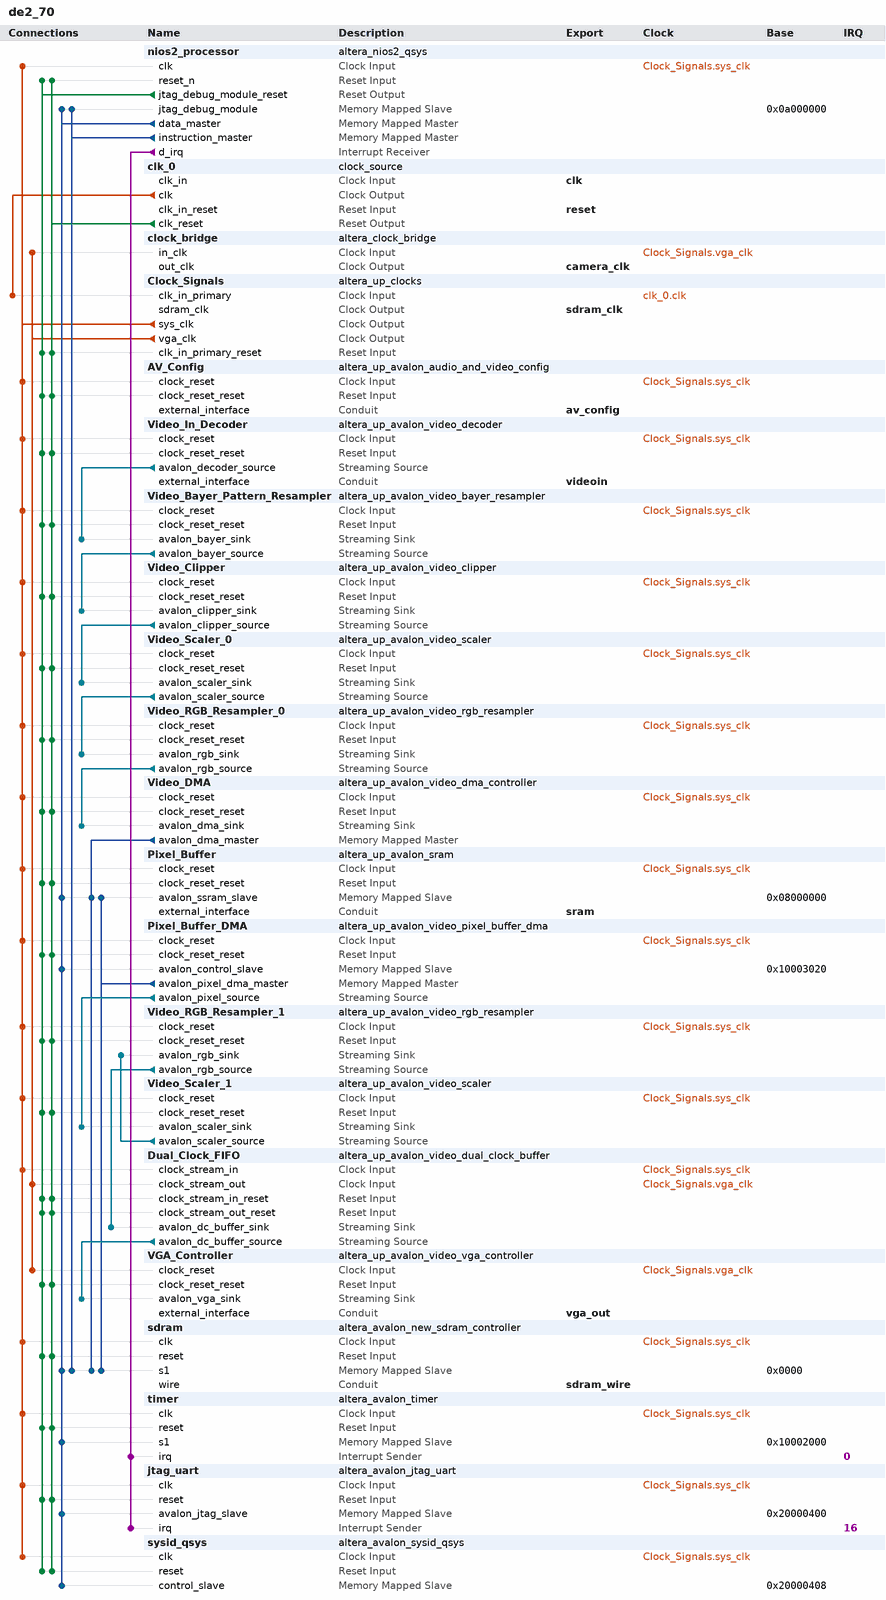
[diagram p0: system contents]
# Platform Designer (Qsys) system de2_70, Cyclone II EP2C70F896C6
# Parameters at their usual value, and those the tool derives, are not listed.
package require -exact qsys 13.0
create_system de2_70
set_project_property DEVICE_FAMILY {Cyclone II}
set_project_property DEVICE EP2C70F896C6

add_instance nios2_processor altera_nios2_qsys 13.0
set_instance_parameter_value nios2_processor resetSlave sdram.s1
set_instance_parameter_value nios2_processor mmu_TLBMissExcSlave None
set_instance_parameter_value nios2_processor exceptionSlave sdram.s1
set_instance_parameter_value nios2_processor breakSlave nios2_processor.jtag_debug_module
set_instance_parameter_value nios2_processor impl Fast
set_instance_parameter_value nios2_processor icache_size 4096

add_instance clk_0 clock_source 13.0
set_instance_parameter_value clk_0 clockFrequency 50000000

add_instance clock_bridge altera_clock_bridge 13.0
set_instance_parameter_value clock_bridge DERIVED_CLOCK_RATE 25000000
set_instance_parameter_value clock_bridge EXPLICIT_CLOCK_RATE 25000000

add_instance Clock_Signals altera_up_clocks 13.0
set_instance_parameter_value Clock_Signals board DE2-70
set_instance_parameter_value Clock_Signals vga_clk true
set_instance_parameter_value Clock_Signals audio_clk false
set_instance_parameter_value Clock_Signals audio_clk_freq 12.288

add_instance AV_Config altera_up_avalon_audio_and_video_config 13.0
set_instance_parameter_value AV_Config board DE2-70
set_instance_parameter_value AV_Config audio_in {Microphone to ADC}
set_instance_parameter_value AV_Config line_in_bypass false
set_instance_parameter_value AV_Config bit_length 24
set_instance_parameter_value AV_Config sampling_rate {48 kHz}

add_instance Video_In_Decoder altera_up_avalon_video_decoder 13.0
set_instance_parameter_value Video_In_Decoder video_source {5MP Daughtercard (THDB_D5M)}

add_instance Video_Bayer_Pattern_Resampler altera_up_avalon_video_bayer_resampler 13.0
set_instance_parameter_value Video_Bayer_Pattern_Resampler use_custom_format true
set_instance_parameter_value Video_Bayer_Pattern_Resampler custom_width_in 2592
set_instance_parameter_value Video_Bayer_Pattern_Resampler custom_height_in 1944

add_instance Video_Clipper altera_up_avalon_video_clipper 13.0
set_instance_parameter_value Video_Clipper width_in 1296
set_instance_parameter_value Video_Clipper height_in 972
set_instance_parameter_value Video_Clipper drop_left 8
set_instance_parameter_value Video_Clipper drop_right 8
set_instance_parameter_value Video_Clipper drop_top 6
set_instance_parameter_value Video_Clipper drop_bottom 6
set_instance_parameter_value Video_Clipper color_bits 8
set_instance_parameter_value Video_Clipper color_planes 3

add_instance Video_Scaler_0 altera_up_avalon_video_scaler 13.0
set_instance_parameter_value Video_Scaler_0 width_scaling 0.25
set_instance_parameter_value Video_Scaler_0 height_scaling 0.25
set_instance_parameter_value Video_Scaler_0 width_in 1280
set_instance_parameter_value Video_Scaler_0 height_in 960
set_instance_parameter_value Video_Scaler_0 color_bits 8
set_instance_parameter_value Video_Scaler_0 color_planes 3

add_instance Video_RGB_Resampler_0 altera_up_avalon_video_rgb_resampler 13.0
set_instance_parameter_value Video_RGB_Resampler_0 input_type {24-bit RGB}
set_instance_parameter_value Video_RGB_Resampler_0 output_type {8-bit Grayscale}
set_instance_parameter_value Video_RGB_Resampler_0 alpha 1023

add_instance Video_DMA altera_up_avalon_video_dma_controller 13.0
set_instance_parameter_value Video_DMA mode {From Stream to Memory}
set_instance_parameter_value Video_DMA addr_mode Consecutive
set_instance_parameter_value Video_DMA start_address 134217728
set_instance_parameter_value Video_DMA back_start_address 134217728
set_instance_parameter_value Video_DMA width 320
set_instance_parameter_value Video_DMA height 240
set_instance_parameter_value Video_DMA color_bits 8
set_instance_parameter_value Video_DMA color_planes 1
set_instance_parameter_value Video_DMA dma_enabled true

add_instance Pixel_Buffer altera_up_avalon_sram 13.0
set_instance_parameter_value Pixel_Buffer board DE2-70
set_instance_parameter_value Pixel_Buffer pixel_buffer true

add_instance Pixel_Buffer_DMA altera_up_avalon_video_pixel_buffer_dma 13.0
set_instance_parameter_value Pixel_Buffer_DMA addr_mode Consecutive
set_instance_parameter_value Pixel_Buffer_DMA start_address 134217728
set_instance_parameter_value Pixel_Buffer_DMA back_start_address 134217728
set_instance_parameter_value Pixel_Buffer_DMA image_width 320
set_instance_parameter_value Pixel_Buffer_DMA image_height 240
set_instance_parameter_value Pixel_Buffer_DMA color_space {8-bit Grayscale}

add_instance Video_RGB_Resampler_1 altera_up_avalon_video_rgb_resampler 13.0
set_instance_parameter_value Video_RGB_Resampler_1 input_type {8-bit Grayscale}
set_instance_parameter_value Video_RGB_Resampler_1 output_type {30-bit RGB}
set_instance_parameter_value Video_RGB_Resampler_1 alpha 1023

add_instance Video_Scaler_1 altera_up_avalon_video_scaler 13.0
set_instance_parameter_value Video_Scaler_1 width_scaling 2
set_instance_parameter_value Video_Scaler_1 height_scaling 2
set_instance_parameter_value Video_Scaler_1 width_in 320
set_instance_parameter_value Video_Scaler_1 color_bits 8
set_instance_parameter_value Video_Scaler_1 color_planes 1

add_instance Dual_Clock_FIFO altera_up_avalon_video_dual_clock_buffer 13.0
set_instance_parameter_value Dual_Clock_FIFO color_bits 10

add_instance VGA_Controller altera_up_avalon_video_vga_controller 13.0
set_instance_parameter_value VGA_Controller board DE2-70

add_instance sdram altera_avalon_new_sdram_controller 13.0.1.99.2
set_instance_parameter_value sdram TAC 5.5
set_instance_parameter_value sdram TRCD 20.0
set_instance_parameter_value sdram TRP 20.0
set_instance_parameter_value sdram casLatency 3
set_instance_parameter_value sdram columnWidth 8
set_instance_parameter_value sdram dataWidth 16
set_instance_parameter_value sdram generateSimulationModel false
set_instance_parameter_value sdram model single_Micron_MT48LC4M32B2_7_chip
set_instance_parameter_value sdram numberOfBanks 4
set_instance_parameter_value sdram numberOfChipSelects 1
set_instance_parameter_value sdram powerUpDelay 100.0
set_instance_parameter_value sdram refreshPeriod 15.625
set_instance_parameter_value sdram rowWidth 12

add_instance timer altera_avalon_timer 13.0.1.99.2
set_instance_parameter_value timer period 1
set_instance_parameter_value timer periodUnits MSEC

add_instance jtag_uart altera_avalon_jtag_uart 13.0.1.99.2
set_instance_parameter_value jtag_uart simInteractiveOptions NO_INTERACTIVE_WINDOWS

add_instance sysid_qsys altera_avalon_sysid_qsys 13.0
set_instance_parameter_value sysid_qsys id 0

# connections
add_connection clk_0.clk Clock_Signals.clk_in_primary clock
add_connection Clock_Signals.sys_clk AV_Config.clock_reset clock
add_connection Clock_Signals.sys_clk Dual_Clock_FIFO.clock_stream_in clock
add_connection Clock_Signals.sys_clk jtag_uart.clk clock
add_connection Clock_Signals.sys_clk nios2_processor.clk clock
add_connection Clock_Signals.sys_clk Pixel_Buffer.clock_reset clock
add_connection Clock_Signals.sys_clk Pixel_Buffer_DMA.clock_reset clock
add_connection Clock_Signals.sys_clk sdram.clk clock
add_connection Clock_Signals.sys_clk sysid_qsys.clk clock
add_connection Clock_Signals.sys_clk timer.clk clock
add_connection Clock_Signals.sys_clk Video_Bayer_Pattern_Resampler.clock_reset clock
add_connection Clock_Signals.sys_clk Video_Clipper.clock_reset clock
add_connection Clock_Signals.sys_clk Video_DMA.clock_reset clock
add_connection Clock_Signals.sys_clk Video_In_Decoder.clock_reset clock
add_connection Clock_Signals.sys_clk Video_RGB_Resampler_0.clock_reset clock
add_connection Clock_Signals.sys_clk Video_RGB_Resampler_1.clock_reset clock
add_connection Clock_Signals.sys_clk Video_Scaler_0.clock_reset clock
add_connection Clock_Signals.sys_clk Video_Scaler_1.clock_reset clock
add_connection Clock_Signals.vga_clk clock_bridge.in_clk clock
add_connection Clock_Signals.vga_clk Dual_Clock_FIFO.clock_stream_out clock
add_connection Clock_Signals.vga_clk VGA_Controller.clock_reset clock
add_connection clk_0.clk_reset AV_Config.clock_reset_reset reset
add_connection clk_0.clk_reset Clock_Signals.clk_in_primary_reset reset
add_connection clk_0.clk_reset Dual_Clock_FIFO.clock_stream_in_reset reset
add_connection clk_0.clk_reset Dual_Clock_FIFO.clock_stream_out_reset reset
add_connection clk_0.clk_reset jtag_uart.reset reset
add_connection clk_0.clk_reset nios2_processor.reset_n reset
add_connection clk_0.clk_reset Pixel_Buffer.clock_reset_reset reset
add_connection clk_0.clk_reset Pixel_Buffer_DMA.clock_reset_reset reset
add_connection clk_0.clk_reset sdram.reset reset
add_connection clk_0.clk_reset sysid_qsys.reset reset
add_connection clk_0.clk_reset timer.reset reset
add_connection clk_0.clk_reset VGA_Controller.clock_reset_reset reset
add_connection clk_0.clk_reset Video_Bayer_Pattern_Resampler.clock_reset_reset reset
add_connection clk_0.clk_reset Video_Clipper.clock_reset_reset reset
add_connection clk_0.clk_reset Video_DMA.clock_reset_reset reset
add_connection clk_0.clk_reset Video_In_Decoder.clock_reset_reset reset
add_connection clk_0.clk_reset Video_RGB_Resampler_0.clock_reset_reset reset
add_connection clk_0.clk_reset Video_RGB_Resampler_1.clock_reset_reset reset
add_connection clk_0.clk_reset Video_Scaler_0.clock_reset_reset reset
add_connection clk_0.clk_reset Video_Scaler_1.clock_reset_reset reset
add_connection nios2_processor.jtag_debug_module_reset AV_Config.clock_reset_reset reset
add_connection nios2_processor.jtag_debug_module_reset Clock_Signals.clk_in_primary_reset reset
add_connection nios2_processor.jtag_debug_module_reset Dual_Clock_FIFO.clock_stream_in_reset reset
add_connection nios2_processor.jtag_debug_module_reset Dual_Clock_FIFO.clock_stream_out_reset reset
add_connection nios2_processor.jtag_debug_module_reset jtag_uart.reset reset
add_connection nios2_processor.jtag_debug_module_reset nios2_processor.reset_n reset
add_connection nios2_processor.jtag_debug_module_reset Pixel_Buffer.clock_reset_reset reset
add_connection nios2_processor.jtag_debug_module_reset Pixel_Buffer_DMA.clock_reset_reset reset
add_connection nios2_processor.jtag_debug_module_reset sdram.reset reset
add_connection nios2_processor.jtag_debug_module_reset sysid_qsys.reset reset
add_connection nios2_processor.jtag_debug_module_reset timer.reset reset
add_connection nios2_processor.jtag_debug_module_reset VGA_Controller.clock_reset_reset reset
add_connection nios2_processor.jtag_debug_module_reset Video_Bayer_Pattern_Resampler.clock_reset_reset reset
add_connection nios2_processor.jtag_debug_module_reset Video_Clipper.clock_reset_reset reset
add_connection nios2_processor.jtag_debug_module_reset Video_DMA.clock_reset_reset reset
add_connection nios2_processor.jtag_debug_module_reset Video_In_Decoder.clock_reset_reset reset
add_connection nios2_processor.jtag_debug_module_reset Video_RGB_Resampler_0.clock_reset_reset reset
add_connection nios2_processor.jtag_debug_module_reset Video_RGB_Resampler_1.clock_reset_reset reset
add_connection nios2_processor.jtag_debug_module_reset Video_Scaler_0.clock_reset_reset reset
add_connection nios2_processor.jtag_debug_module_reset Video_Scaler_1.clock_reset_reset reset
add_connection nios2_processor.data_master jtag_uart.avalon_jtag_slave avalon
set_connection_parameter_value nios2_processor.data_master/jtag_uart.avalon_jtag_slave baseAddress 0x20000400
add_connection nios2_processor.data_master nios2_processor.jtag_debug_module avalon
set_connection_parameter_value nios2_processor.data_master/nios2_processor.jtag_debug_module baseAddress 0x0a000000
add_connection nios2_processor.data_master Pixel_Buffer.avalon_ssram_slave avalon
set_connection_parameter_value nios2_processor.data_master/Pixel_Buffer.avalon_ssram_slave baseAddress 0x08000000
add_connection nios2_processor.data_master Pixel_Buffer_DMA.avalon_control_slave avalon
set_connection_parameter_value nios2_processor.data_master/Pixel_Buffer_DMA.avalon_control_slave baseAddress 0x10003020
add_connection nios2_processor.data_master sdram.s1 avalon
set_connection_parameter_value nios2_processor.data_master/sdram.s1 baseAddress 0x0000
add_connection nios2_processor.data_master sysid_qsys.control_slave avalon
set_connection_parameter_value nios2_processor.data_master/sysid_qsys.control_slave baseAddress 0x20000408
add_connection nios2_processor.data_master timer.s1 avalon
set_connection_parameter_value nios2_processor.data_master/timer.s1 baseAddress 0x10002000
add_connection nios2_processor.instruction_master nios2_processor.jtag_debug_module avalon
set_connection_parameter_value nios2_processor.instruction_master/nios2_processor.jtag_debug_module baseAddress 0x0a000000
add_connection nios2_processor.instruction_master sdram.s1 avalon
set_connection_parameter_value nios2_processor.instruction_master/sdram.s1 baseAddress 0x0000
add_connection Pixel_Buffer_DMA.avalon_pixel_dma_master Pixel_Buffer.avalon_ssram_slave avalon
set_connection_parameter_value Pixel_Buffer_DMA.avalon_pixel_dma_master/Pixel_Buffer.avalon_ssram_slave baseAddress 0x08000000
add_connection Pixel_Buffer_DMA.avalon_pixel_dma_master sdram.s1 avalon
set_connection_parameter_value Pixel_Buffer_DMA.avalon_pixel_dma_master/sdram.s1 baseAddress 0x0000
add_connection Video_DMA.avalon_dma_master Pixel_Buffer.avalon_ssram_slave avalon
set_connection_parameter_value Video_DMA.avalon_dma_master/Pixel_Buffer.avalon_ssram_slave baseAddress 0x08000000
add_connection Video_DMA.avalon_dma_master sdram.s1 avalon
set_connection_parameter_value Video_DMA.avalon_dma_master/sdram.s1 baseAddress 0x0000
add_connection Dual_Clock_FIFO.avalon_dc_buffer_source VGA_Controller.avalon_vga_sink avalon_streaming
add_connection Pixel_Buffer_DMA.avalon_pixel_source Video_Scaler_1.avalon_scaler_sink avalon_streaming
add_connection Video_Bayer_Pattern_Resampler.avalon_bayer_source Video_Clipper.avalon_clipper_sink avalon_streaming
add_connection Video_Clipper.avalon_clipper_source Video_Scaler_0.avalon_scaler_sink avalon_streaming
add_connection Video_In_Decoder.avalon_decoder_source Video_Bayer_Pattern_Resampler.avalon_bayer_sink avalon_streaming
add_connection Video_RGB_Resampler_0.avalon_rgb_source Video_DMA.avalon_dma_sink avalon_streaming
add_connection Video_RGB_Resampler_1.avalon_rgb_source Dual_Clock_FIFO.avalon_dc_buffer_sink avalon_streaming
add_connection Video_Scaler_0.avalon_scaler_source Video_RGB_Resampler_0.avalon_rgb_sink avalon_streaming
add_connection Video_Scaler_1.avalon_scaler_source Video_RGB_Resampler_1.avalon_rgb_sink avalon_streaming
add_connection nios2_processor.d_irq jtag_uart.irq interrupt
set_connection_parameter_value nios2_processor.d_irq/jtag_uart.irq irqNumber 16
add_connection nios2_processor.d_irq timer.irq interrupt
set_connection_parameter_value nios2_processor.d_irq/timer.irq irqNumber 0

# exported interfaces
add_interface clk clock sink
set_interface_property clk EXPORT_OF clk_0.clk_in
add_interface reset reset sink
set_interface_property reset EXPORT_OF clk_0.clk_in_reset
add_interface sram conduit end
set_interface_property sram EXPORT_OF Pixel_Buffer.external_interface
add_interface sdram_clk clock source
set_interface_property sdram_clk EXPORT_OF Clock_Signals.sdram_clk
add_interface vga_out conduit end
set_interface_property vga_out EXPORT_OF VGA_Controller.external_interface
add_interface sdram_wire conduit end
set_interface_property sdram_wire EXPORT_OF sdram.wire
add_interface av_config conduit end
set_interface_property av_config EXPORT_OF AV_Config.external_interface
add_interface videoin conduit end
set_interface_property videoin EXPORT_OF Video_In_Decoder.external_interface
add_interface camera_clk clock source
set_interface_property camera_clk EXPORT_OF clock_bridge.out_clk

set_interconnect_requirement {$system} qsys_mm.clockCrossingAdapter HANDSHAKE
set_interconnect_requirement {$system} qsys_mm.maxAdditionalLatency 1

save_system de2_70.qsys
